# EAGLE design Dashboard rev0 (EAGLE 7.7.0)
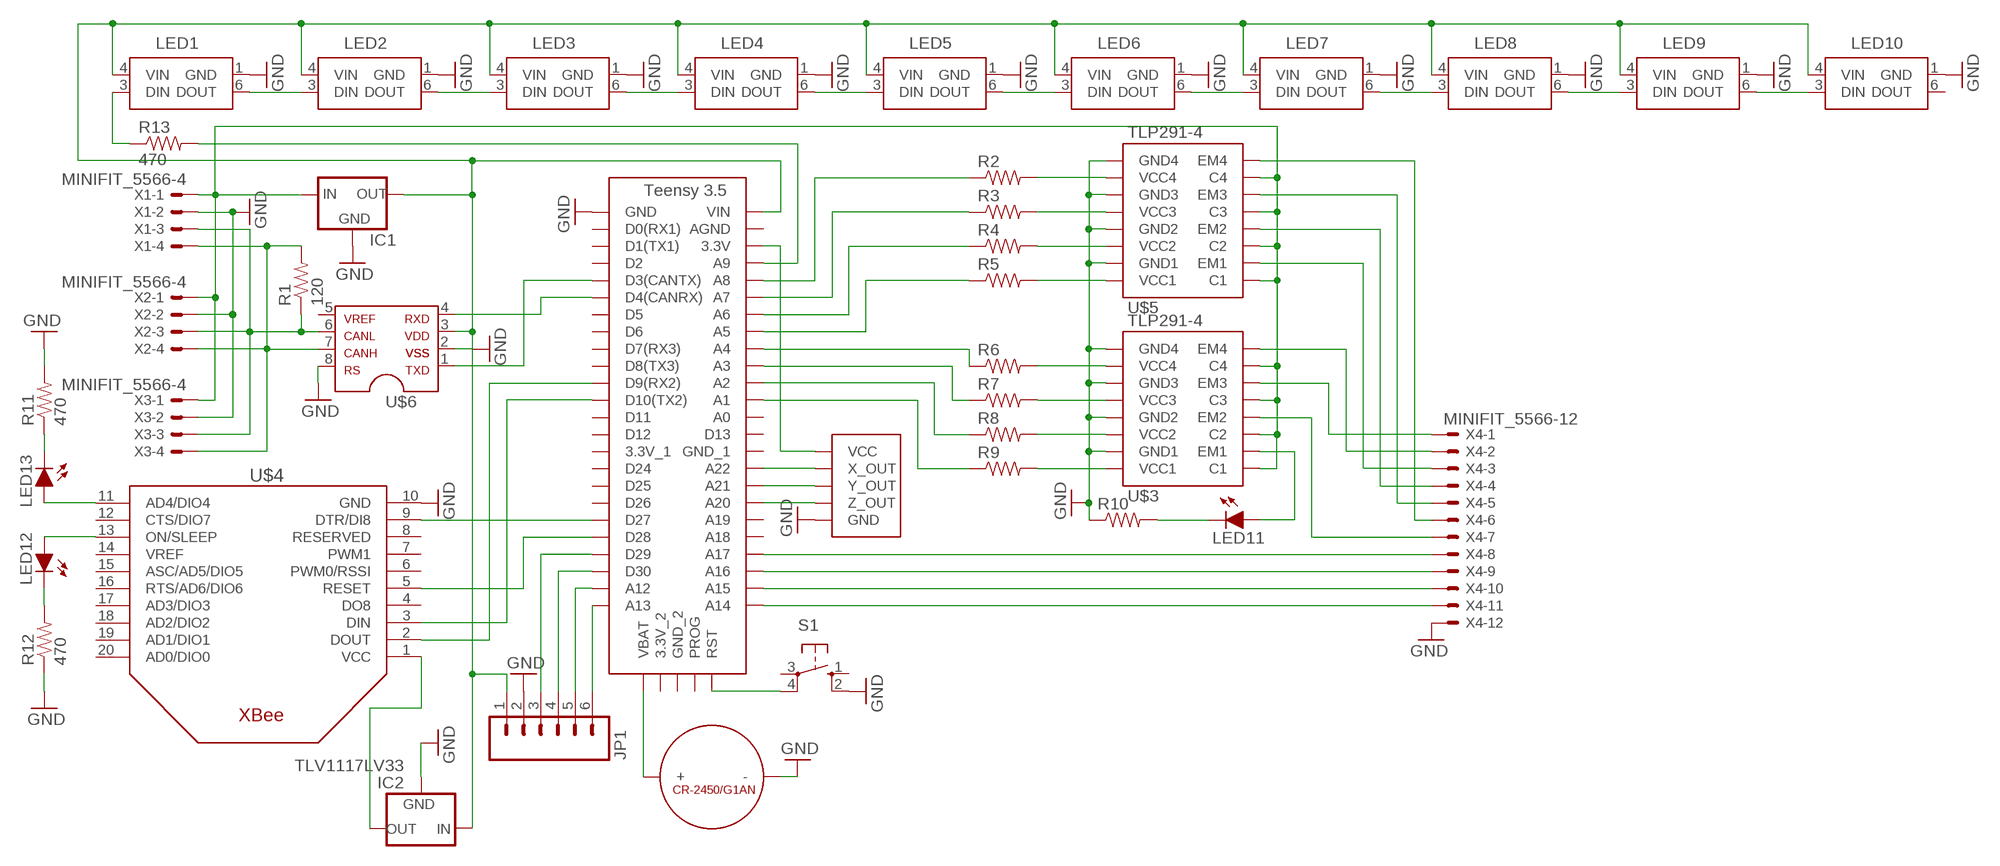
[diagram p0: schematic, sheet 1]

## Parts
IC1  5VREG_L7805_HOR  [TO-220-H]
IC2  TLV1117LV33  [SOT223]
JP1  M06  [1X06]
LED1  WS2812B5050  [RGBLED5050]
LED2  WS2812B5050  [RGBLED5050]
LED3  WS2812B5050  [RGBLED5050]
LED4  WS2812B5050  [RGBLED5050]
LED5  WS2812B5050  [RGBLED5050]
LED6  WS2812B5050  [RGBLED5050]
LED7  WS2812B5050  [RGBLED5050]
LED8  WS2812B5050  [RGBLED5050]
LED9  WS2812B5050  [RGBLED5050]
LED10  WS2812B5050  [RGBLED5050]
LED11  LED-0805  [LED-805]
LED12  LED-0805  [LED-805]
LED13  LED-0805  [LED-805]
R1  120  RESISTOR0805-RES  [0805]
R2  RESISTOR0805-RES  [0805]
R3  RESISTOR0805-RES  [0805]
R4  RESISTOR0805-RES  [0805]
R5  RESISTOR0805-RES  [0805]
R6  RESISTOR0805-RES  [0805]
R7  RESISTOR0805-RES  [0805]
R8  RESISTOR0805-RES  [0805]
R9  RESISTOR0805-RES  [0805]
R10  RESISTOR0805-RES  [0805]
R11  470  RESISTOR0805-RES  [0805]
R12  470  RESISTOR0805-RES  [0805]
R13  470  RESISTOR0805-RES  [0805]
S1  BTN_10-XX  [B3F-10XX]
U$1  TEENSY_3.5_SIMPLE_RTC  [TEENSY_3.5_SIMPLE_RTC]
U$2  CR-2450/G1AN  [CR-2450/G1AN]
U$3  TLP291-4  [SOIC-16]
U$4  XBEE  [XBEE]
U$5  TLP291-4  [SOIC-16]
U$6  MCP2551  [SOIC-08]
U$7  ADXL335  [ADXL335]
X1  MINIFIT_5566-4  [MINIFIT_5566-4]
X2  MINIFIT_5566-4  [MINIFIT_5566-4]
X3  MINIFIT_5566-4  [MINIFIT_5566-4]
X4  MINIFIT_5566-12  [MINIFIT_5566-12]

## Nets
GND: IC1.2(GND) IC2.1(GND) JP1.2 LED1.1(GND) LED2.1(GND) LED3.1(GND) LED4.1(GND) LED5.1(GND) LED6.1(GND) LED7.1(GND) LED8.1(GND) LED9.1(GND) LED10.1(GND) R10.1 R11.2 R12.1 S1.2(S1) U$1.GND U$2.- U$3.2(GND1) U$3.4(GND2) U$3.6(GND3) U$3.8(GND4) U$4.10(GND) U$5.2(GND1) U$5.4(GND2) U$5.6(GND3) U$5.8(GND4) U$6.2 U$6.8 U$7.GND X1.2 X2.2 X3.2 X4.12
N$1: U$1.VBAT U$2.+_0(+) U$2.+_1(+)
N$2: R2.2 U$5.7(VCC4)
N$3: LED1.6(DOUT) LED2.3(DIN)
N$4: LED2.6(DOUT) LED3.3(DIN)
N$5: LED3.6(DOUT) LED4.3(DIN)
N$6: LED4.6(DOUT) LED5.3(DIN)
N$7: LED5.6(DOUT) LED6.3(DIN)
N$8: LED6.6(DOUT) LED7.3(DIN)
N$9: LED7.6(DOUT) LED8.3(DIN)
N$10: LED8.6(DOUT) LED9.3(DIN)
N$11: LED9.6(DOUT) LED10.3(DIN)
N$12: R3.2 U$5.5(VCC3)
N$13: U$1.D3(CANTX) U$6.1
N$14: IC1.1(IN) U$3.10(C4) U$3.12(C3) U$3.14(C2) U$3.16(C1) U$5.10(C4) U$5.12(C3) U$5.14(C2) U$5.16(C1) X1.1 X2.1 X3.1
N$15: U$1.D4(CANRX) U$6.4
N$16: R1.1 U$6.6 X1.3 X2.3 X3.3
N$17: R1.2 U$6.7 X1.4 X2.4 X3.4
N$18: LED12.A U$4.13(ON/SLEEP)
N$19: R13.2 U$1.A9
N$20: R2.1 U$1.A8
N$21: R3.1 U$1.A7
N$22: R4.1 U$1.A6
N$23: R5.1 U$1.A5
N$24: R6.1 U$1.A4
N$25: R7.1 U$1.A3
N$26: R8.1 U$1.A2
N$27: R9.1 U$1.A1
N$28: R4.2 U$5.3(VCC2)
N$29: R5.2 U$5.1(VCC1)
N$30: R6.2 U$3.7(VCC4)
N$31: R7.2 U$3.5(VCC3)
N$32: R8.2 U$3.3(VCC2)
N$33: R9.2 U$3.1(VCC1)
N$36: U$1.3.3V U$7.VCC
N$37: U$1.A22 U$7.X_OUT
N$38: U$1.A21 U$7.Y_OUT
N$39: U$1.A20 U$7.Z_OUT
N$40: S1.4(P1) U$1.RST
N$41: U$1.D28 U$4.5(RESET)
N$42: U$1.A14 X4.11
N$43: U$1.A16 X4.9
N$44: U$5.9(EM4) X4.6
N$45: U$5.11(EM3) X4.5
N$46: U$5.13(EM2) X4.4
N$47: U$5.15(EM1) X4.3
N$48: U$3.9(EM4) X4.2
N$49: U$3.11(EM3) X4.1
N$50: U$3.13(EM2) X4.7
N$51: LED11.A U$3.15(EM1)
N$52: U$1.A17 X4.8
N$53: U$1.A15 X4.10
N$54: U$1.D9(RX2) U$4.2(DOUT)
N$55: U$1.D10(TX2) U$4.3(DIN)
N$56: U$1.D27 U$4.9(DTR/DI8)
N$57: LED11.C R10.2
N$58: LED13.A U$4.11(AD4/DIO4)
N$59: LED13.C R11.1
N$60: LED12.C R12.2
N$61: IC1.3(OUT) IC2.3(IN) JP1.1 LED1.4(VIN) LED2.4(VIN) LED3.4(VIN) LED4.4(VIN) LED5.4(VIN) LED6.4(VIN) LED7.4(VIN) LED8.4(VIN) LED9.4(VIN) LED10.4(VIN) U$1.VIN U$6.3
N$62: JP1.5 U$1.A12
N$63: JP1.4 U$1.D30
N$64: JP1.3 U$1.D29
N$65: JP1.6 U$1.A13
N$66: LED1.3(DIN) R13.1
VCC: IC2.2(OUT) IC2.4(OUT) U$4.1(VCC)
Unconnected: LED10.6(DOUT) S1.1(S) S1.3(P) U$1.3.3V_1 U$1.3.3V_2 U$1.A0 U$1.A18 U$1.A19 U$1.AGND U$1.D0(RX1) U$1.D1(TX1) U$1.D2 U$1.D5 U$1.D6 U$1.D7(RX3) U$1.D8(TX3) U$1.D11 U$1.D12 U$1.D13 U$1.D24 U$1.D25 U$1.D26 U$1.GND_1 U$1.GND_2 U$1.PROG U$4.4(DO8) U$4.6(PWM0/RSSI) U$4.7(PWM1) U$4.8(RESERVED) U$4.12(CTS/DIO7) U$4.14(VREF) U$4.15(ASC/AD5/DIO5) U$4.16(RTS/AD6/DIO6) U$4.17(AD3/DIO3) U$4.18(AD2/DIO2) U$4.19(AD1/DIO1) U$4.20(AD0/DIO0) U$6.5

## Library data of the parts
IC1 = HyTechDevices:5VREG_L7805: Voltage Regulator Switching 5v regulator Datasheet <http://power.murata.com/data/power/oki-78sr.pdf> Standard 7805 5V regulator. IGO (Input Ground Output). Spark Fun Electronics SKU : COM-00107 Datasheet <http://www.mouser.com/ds/2/308/MC7800-D-94905.pdf>
IC2 = HyTechDevices:TLV1117LV33: Texas Instruments TLV1117LV33 3.3V Linear Regulator
JP1 = HyTechDevices:M06: Standard 6-pin 0.1" header. NOTES ON THE VARIANTS LOCK and LOCK_LONGPADS... This footprint was designed to help hold the alignment of a through-hole component (i.e. 6-pin header) while soldering it into place. You may notice that each hole has been shifted either up or down by 0.005 of an inch from it's more standard position (which is a perfectly straight line). This slight alteration caused the pins (the squares in the middle) to touch the edges of the holes. Because they are alternating, it causes a "brace" to hold the component in place. 0.005 has proven to be the perfect amount of "off-center" position when using our standard breakaway headers. Although looks a little odd when you look at the bare footprint, once you have a header in there, the alteration is very hard to notice. Also,if you push a header all the way into place, it is covered up entirely on the bottom side. This idea of altering the position of holes to aid alignment will be further integrated into the Sparkfun Library for other footprints. It can help hold any component with 3 or more connection pins. Note: The Sparkfun version includes many other packages including surface mount that may be of future interest. Source: Sparkfun <https://github.com/sparkfun/SparkFun-Eagle-Libraries>
LED1-LED10 = HyTechDevices:WS2812B: 4 Pin RBG LED individually addressable. Source: Adafruit
LED11-LED13 = HyTechDevices:LED: Light Emitting Diode (LED) Source: Dangerous Prototypes Eagle Library <https://github.com/DangerousPrototypes/Eagle_Part_Library>
R1-R13 = HyTechDevices:RESISTOR: Resistor Basic schematic elements and footprints for 0603, 1206, and PTH resistors.
S1 = HyTechDevices:BTN_10-XX: OMRON SWITCH; MPN: B3F-1000; OC_FARNELL: 176432; OC_NEWARK: 36M3542
U$1 = HyTechDevices:TEENSY_3.5_SIMPLE_RTC: Simple version of the Teensy 3.5 board that only uses the 2 main rows of pins, plus the perpendicular row with VBat.
U$2 = HyTechDevices:CR-2450/G1AN: Panasonic CR2450 Battery through hole.
U$3 U$5 = HyTechDevices:TLP291-4: Toshiba Quad Channel Optocoupler TLP291-4
U$4 = HyTechDevices:XBEE: Source: Adafruit <https://github.com/adafruit/Adafruit-Eagle-Library>
U$6 = HyTechDevices:MCP2551: MCP2551 High-Speed CAN Transceiver Product Webpage <https://www.microchip.com/wwwproducts/en/MCP2551> Datasheet <http://ww1.microchip.com/downloads/en/DeviceDoc/21667f.pdf> This device is outdated It is replaced by MCP2561. Comparison Page <https://www.microchip.com/wwwproducts/ProductCompare/MCP2551/MCP2561> Product Webpage <https://www.microchip.com/wwwproducts/en/MCP2561> Datasheet <http://ww1.microchip.com/downloads/en/DeviceDoc/20005167C.pdf>
U$7 = HyTechDevices:ADXL335: ADXL335 3-axis accelerometer breakout board
X1-X3 = HyTechDevices:MINIFIT_5566-4: Mini-Fit Junior connector 4 pole Source: http://www.molex.com; OC_FARNELL: unknown; OC_NEWARK: unknown
X4 = HyTechDevices:MINIFIT_5566-12: Mini-Fit Junior connector 12 pole Source: http://www.molex.com; OC_FARNELL: unknown; OC_NEWARK: unknown

## Board
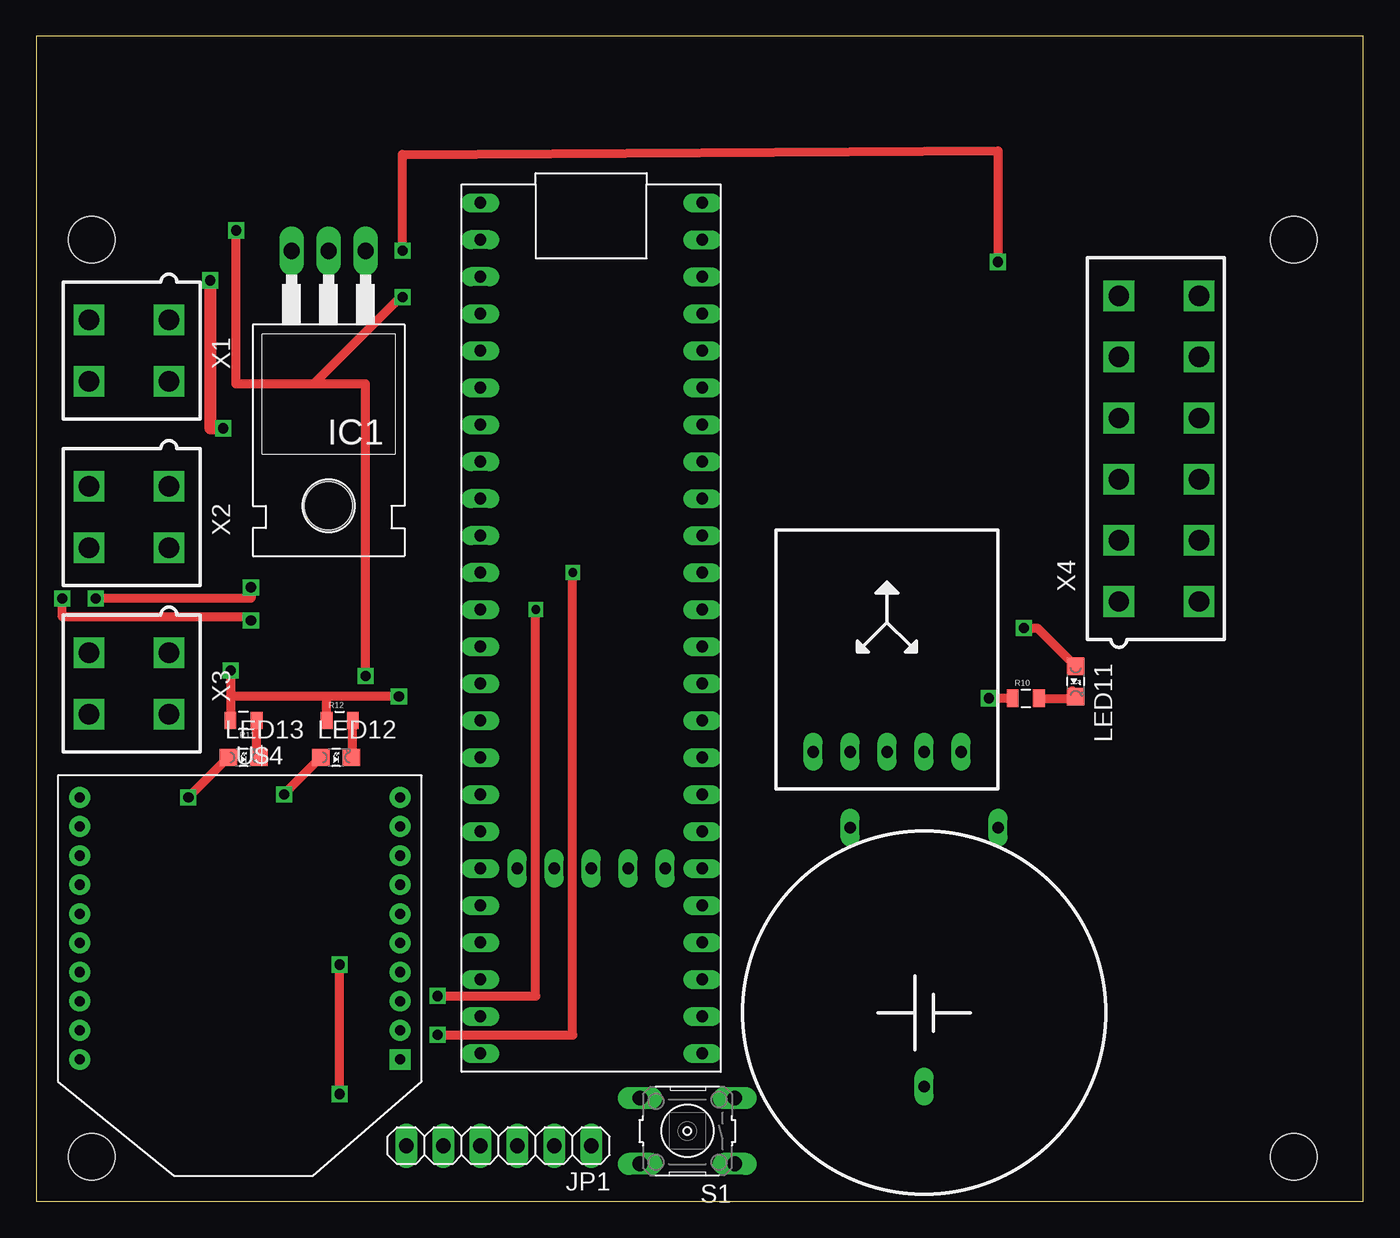
[diagram p1: board, top side]
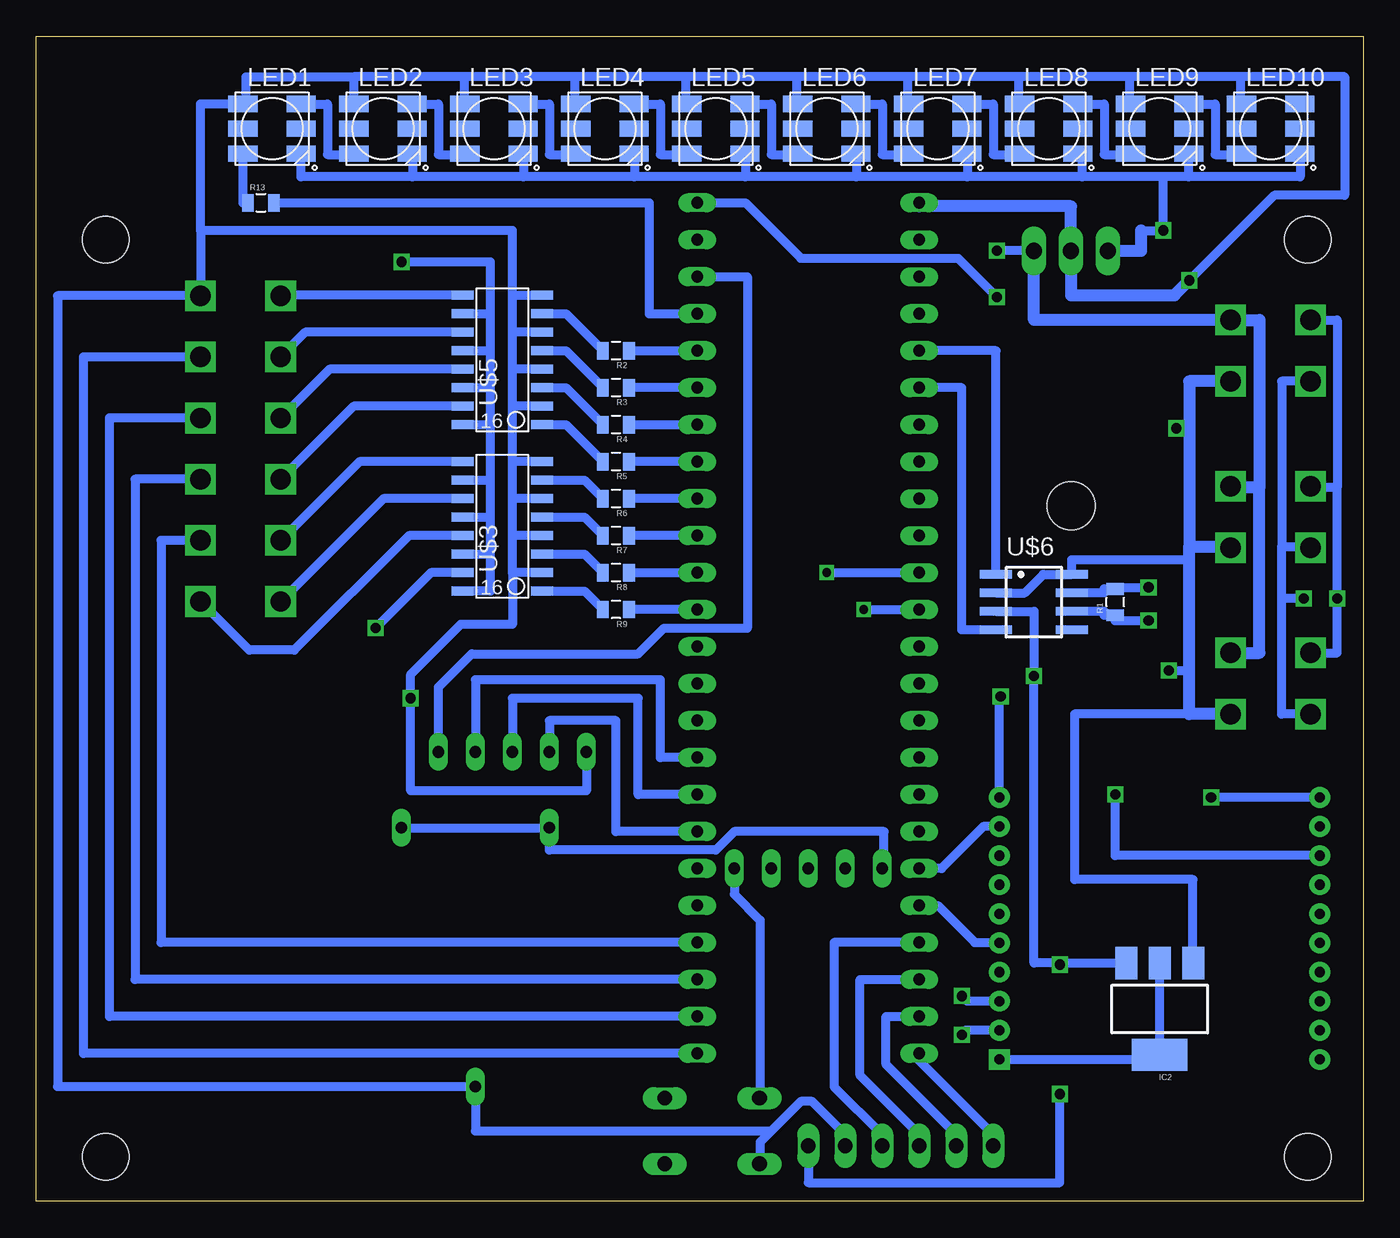
[diagram p2: board, bottom side, seen from below]

Size 91.11 x 80 mm. Coordinates in mm from the lower left corner, seen from the top.
Outline: 0,0 91.11,0 91.11,80 0,80 0,0
Copper layers (1*16): Top 0.035mm / dielectric 1.5mm / Bottom 0.035mm
Design rules "default": minimum track width 10mil, minimum drill 24mil, track to track 8mil, track to pad 8mil, pad to pad 8mil, via to via 8mil, smd to smd 8mil, copper to edge 40mil, drill to drill 8mil, minimum pad ring 10mil, minimum via ring 8mil, stop-mask expansion 4mil, vias tented up to drill 0mil, thermal gap 10mil
Holes 3.2 mm at 86.36,3.05 3.81,3.05 3.81,66.04 86.36,66.04

### Footprints (pad centres in the part's own frame; a part is rotated, then mirrored left to right if it is on the bottom)
TO-220-H = drill 1.118 long: 1 -2.54,-6.35; 2 0,-6.35; 3 2.54,-6.35 | hole 3.302: 0,11.176
SOT223 = smd 1.5 x 2.235: 1 -2.3,-3.15; 2 0,-3.15; 3 2.3,-3.15 | smd 3.8 x 2.2: 4 0,3.15
1X06 = drill 1.016 long: 1 -6.35,0; 2 -3.81,0; 3 -1.27,0; 4 1.27,0; 5 3.81,0; 6 6.35,0
RGBLED5050 = smd 2 x 1.1: 1 -2,1.7; 2 -2,0; 3 -2,-1.7; 4 2,-1.7; 5 2,0; 6 2,1.7
LED-805 = smd 1.2 x 1.2: A 0,-1.05; C 0,1.05
0805 = smd 0.8 x 1.2: 1 -0.9,0; 2 0.9,0
B3F-10XX = drill 1.016 long: 1 -3.251,2.261; 2 3.251,2.261; 3 -3.251,-2.261; 4 3.251,-2.261
TEENSY_3.5_SIMPLE_RTC = drill 0.8 long: 3.3V 16.51,54.61; 3.3V_1 1.27,24.13; 3.3V_2 6.35,13.97; A0 16.51,29.21; A1 16.51,31.75; A2 16.51,34.29; A3 16.51,36.83; A4 16.51,39.37; A5 16.51,41.91; A6 16.51,44.45; A7 16.51,46.99; A8 16.51,49.53; A9 16.51,52.07; A12 1.27,3.81; A13 1.27,1.27; A14 16.51,1.27; A15 16.51,3.81; A16 16.51,6.35; A17 16.51,8.89; A18 16.51,11.43; A19 16.51,13.97; A20 16.51,16.51; A21 16.51,19.05; A22 16.51,21.59; AGND 16.51,57.15; D0(RX1) 1.27,57.15; D1(TX1) 1.27,54.61; D2 1.27,52.07; D3(CANTX) 1.27,49.53; D4(CANRX) 1.27,46.99; D5 1.27,44.45; D6 1.27,41.91; D7(RX3) 1.27,39.37; D8(TX3) 1.27,36.83; D9(RX2) 1.27,34.29; D10(TX2) 1.27,31.75; D11 1.27,29.21; D12 1.27,26.67; D13 16.51,26.67; D24 1.27,21.59; D25 1.27,19.05; D26 1.27,16.51; D27 1.27,13.97; D28 1.27,11.43; D29 1.27,8.89; D30 1.27,6.35; GND 1.27,59.69; GND_1 16.51,24.13; GND_2 8.89,13.97; PROG 11.43,13.97; RST 13.97,13.97; VBAT 3.81,13.97; VIN 16.51,59.69
CR-2450/G1AN = drill 0.8 long: +_0 -5.08,12.7; +_1 5.08,12.7; - 0,-5.08
SOIC-16 = smd 0.61 x 1.524: 1 -4.445,-2.794; 2 -3.175,-2.794; 3 -1.905,-2.794; 4 -0.635,-2.794; 5 0.635,-2.794; 6 1.905,-2.794; 7 3.175,-2.794; 8 4.445,-2.794; 9 4.445,2.667; 10 3.175,2.667; 11 1.905,2.667; 12 0.635,2.667; 13 -0.635,2.667; 14 -1.905,2.667; 15 -3.175,2.667; 16 -4.445,2.667
XBEE = drill 0.7 pad 1.422 square: 1 -11,5.5 | drill 0.7 pad 1.422: 2 -11,3.5; 3 -11,1.5; 4 -11,-0.5; 5 -11,-2.5; 6 -11,-4.5; 7 -11,-6.5; 8 -11,-8.5; 9 -11,-10.5; 10 -11,-12.5; 11 11,-12.5; 12 11,-10.5; 13 11,-8.5; 14 11,-6.5; 15 11,-4.5; 16 11,-2.5; 17 11,-0.5; 18 11,1.5; 19 11,3.5; 20 11,5.5
SOIC-08 = smd 0.6 x 2.2: 1 -1.905,-2.6; 2 -0.635,-2.6; 3 0.635,-2.6; 4 1.905,-2.6; 5 1.905,2.6; 6 0.635,2.6; 7 -0.635,2.6; 8 -1.905,2.6
ADXL335 = drill 0.8 long: GND 2.54,2.54; VCC 12.7,2.54; X_OUT 10.16,2.54; Y_OUT 7.62,2.54; Z_OUT 5.08,2.54
MINIFIT_5566-4 = drill 1.4 square: 1 2.1,-2.75; 2 -2.1,-2.75; 3 2.1,2.75; 4 -2.1,2.75
MINIFIT_5566-12 = drill 1.4 square: 1 10.5,-2.75; 2 6.3,-2.75; 3 2.1,-2.75; 4 -2.1,-2.75; 5 -6.3,-2.75; 6 -10.5,-2.75; 7 10.5,2.75; 8 6.3,2.75; 9 2.1,2.75; 10 -2.1,2.75; 11 -6.3,2.75; 12 -10.5,2.75

### Placement (x,y rotation side)
IC1  20.07,58.93 180 top
IC2  13.97,13.21 180 bottom
JP1  31.75,3.81 180 top
LED1  74.93,73.66 0 bottom
LED2  67.31,73.66 0 bottom
LED3  59.69,73.66 0 bottom
LED4  52.07,73.66 0 bottom
LED5  44.45,73.66 0 bottom
LED6  36.83,73.66 0 bottom
LED7  29.21,73.66 0 bottom
LED8  21.59,73.66 0 bottom
LED9  13.97,73.66 0 bottom
LED10  6.35,73.66 0 bottom
LED11  71.37,35.69 180 top
LED12  20.57,30.48 270 top
LED13  14.22,30.48 270 top
R1  17.02,41.15 90 bottom
R2  51.31,58.42 180 bottom
R3  51.31,55.88 180 bottom
R4  51.31,53.34 180 bottom
R5  51.31,50.8 180 bottom
R6  51.31,48.26 180 bottom
R7  51.31,45.72 180 bottom
R8  51.31,43.18 180 bottom
R9  51.31,40.64 180 bottom
R10  67.94,34.54 0 top
R11  14.22,33.02 180 top
R12  20.83,33.02 0 top
R13  75.69,68.58 0 bottom
S1  44.7,4.83 180 top
U$1  29.21,8.89 0 top
U$2  60.96,12.95 0 top
U$3  59.18,46.35 90 bottom
U$4  13.97,15.24 180 top
U$5  59.18,57.78 90 bottom
U$6  22.61,41.15 270 bottom
U$7  50.8,28.32 0 top
X1  6.35,58.42 90 top
X2  6.35,46.99 90 top
X3  6.35,35.56 90 top
X4  77.09,51.69 270 top

### Tracks (layer width: path | path; a pad name or v marks a point on that pad's centre or on a via)
GND  (via drill 0.7)
  Top 0.61: R12.1 19.93,34.67 | 19.93,34.67 13.34,34.67 | 13.34,34.67 13.34,33.02 R11.2 | v24.89,34.67 19.93,34.67 | v13.34,36.45 13.34,34.67 | R10.1 v65.41,34.54
  Top 0.813: v11.94,63.25 11.94,53.09 v12.83,53.09
  Bottom 0.61: 69.31,77.22 76.71,77.22 76.71,75.36 LED1.1 79.84,75.36 79.84,66.67 | 69.31,77.22 LED2.1 | LED3.1 61.72,75.36 61.72,77.22 | 61.72,77.22 69.31,77.22 | LED4.1 54.1,75.36 54.1,77.22 | 54.1,77.22 61.72,77.22 | LED10.1 8.38,75.36 8.38,77.22 | 8.38,77.22 16,77.22 | 16,77.22 23.62,77.22 | 23.62,77.22 31.24,77.22 | 31.24,77.22 38.86,77.22 | 38.86,77.22 46.48,77.22 | 46.48,77.22 54.1,77.22 | LED9.1 16,75.36 16,77.22 | LED8.1 23.62,75.36 23.62,77.22 | LED7.1 31.24,75.36 31.24,77.22 | LED6.1 38.86,75.36 38.86,77.22 | LED5.1 46.48,75.36 46.48,77.22 | 11.94,33.46 19.81,33.46 19.81,22.1 11.68,22.1 11.68,16.36 IC2.1 | JP1.2 35.56,4.57 37.85,6.86 38.61,6.86 40.64,4.83 | 40.64,4.83 41.4,4.06 41.4,2.62 S1.2 | 8.38,77.22 1.27,77.22 1.27,69.09 6.1,69.09 v11.94,63.25 | 40.64,4.83 60.96,4.83 U$2.- 89.66,7.87 89.66,62.19 X4.12 79.84,66.67 | U$6.2 23.24,41.78 21.97,43.05 U$6.8 20.01,44.07 11.94,44.07 | U$4.10 24.97,34.54 v24.89,34.67 | v13.34,36.45 11.94,36.45 | U$3.2 58.42,43.18 | 58.42,43.18 58.42,45.72 | 58.42,45.72 58.42,48.26 | 58.42,48.26 58.42,50.8 | 58.42,50.8 58.42,54.61 | 58.42,54.61 58.42,57.15 | 58.42,57.15 58.42,59.69 | 58.42,59.69 58.42,62.23 | 58.42,62.23 U$5.8 | U$5.6 58.42,59.69 | U$5.4 58.42,57.15 | U$5.2 58.42,54.61 | U$3.8 58.42,50.8 | U$3.6 58.42,48.26 | U$3.4 58.42,45.72 | 58.42,62.23 58.42,66.67 79.84,66.67 | U$7.GND 53.34,28.19 65.41,28.19 v65.41,34.54 65.41,36.2 61.98,39.62 58.42,39.62 58.42,43.18
  Bottom 0.813: X1.2 11.94,56.32 11.94,52.96 | 11.94,52.96 11.94,44.96 | 11.94,44.96 9.1,44.96 | X3.2 11.94,33.46 11.94,36.45 11.94,44.07 11.94,44.96 | U$1.GND 30.48,68.33 20.07,68.33 IC1.2 20.07,62.23 12.95,62.23 v11.94,63.25 | v12.83,53.09 12.06,53.09 11.94,52.96
  Bottom 1.016: 9.1,44.96 X2.2
N$1
  Bottom 0.61: U$2.+_1 U$2.+_0 55.88,24.13 44.45,24.13 43.18,25.4 32.89,25.4 32.89,22.86 U$1.VBAT
N$2
  Bottom 0.61: U$5.7 54.75,60.96 R2.2
N$3
  Bottom 0.61: LED1.6 71.12,75.36 71.12,71.88 69.31,71.88 LED2.3
N$4
  Bottom 0.61: LED2.6 63.5,75.36 63.5,71.88 61.69,71.88 LED3.3
N$5
  Bottom 0.61: LED3.6 55.88,75.36 55.88,71.88 54.07,71.88 LED4.3
N$6
  Bottom 0.61: LED4.6 48.26,75.36 48.26,71.88 46.45,71.88 LED5.3
N$7
  Bottom 0.61: LED5.6 40.64,75.36 40.64,71.88 38.83,71.88 LED6.3
N$8
  Bottom 0.61: LED6.6 33.02,75.36 33.02,71.88 31.21,71.88 LED7.3
N$9
  Bottom 0.61: LED7.6 25.4,75.36 25.4,71.88 23.59,71.88 LED8.3
N$10
  Bottom 0.61: LED8.6 17.78,75.36 17.78,71.88 15.97,71.88 LED9.3
N$11
  Bottom 0.61: LED9.6 10.16,75.36 10.16,71.88 8.35,71.88 LED10.3
N$12
  Bottom 0.61: U$5.5 54.75,58.42 R3.2
N$13
  Bottom 0.61: U$6.1 25.21,58.42 U$1.D3(CANTX)
N$14  (via drill 0.7)
  Top 0.61: v25.15,65.28 25.15,71.88 66.04,72.14 v66.04,64.52
  Bottom 0.61: IC1.1 v25.15,65.28 | U$5.10 59.94,60.96 | 59.94,60.96 59.94,58.42 | 59.94,58.42 59.94,55.88 | 59.94,55.88 59.94,53.34 | 59.94,53.34 59.94,49.53 | 59.94,49.53 59.94,46.99 | 59.94,46.99 59.94,44.45 | 59.94,44.45 59.94,41.91 U$3.16 | U$3.14 59.94,44.45 | U$3.12 59.94,46.99 | U$3.10 59.94,49.53 | U$5.16 59.94,53.34 | U$5.14 59.94,55.88 | U$5.12 59.94,58.42 | v66.04,64.52 59.94,64.52 59.94,60.96
  Bottom 0.813: 7.11,49.02 7.11,60.52 X1.1 22.61,60.52 IC1.1 | 7.11,49.02 9.1,49.02 | X3.1 7.11,37.66 7.11,49.02
  Bottom 1.016: 9.1,49.02 X2.1
N$15
  Bottom 0.61: U$6.4 27.56,39.24 27.56,55.88 U$1.D4(CANRX)
N$16  (via drill 0.7)
  Top 0.61: v14.73,39.88 14.73,40.13 1.78,40.13 v1.78,41.4
  Bottom 0.61: X1.3 1.78,60.52 1.78,49.02 | 1.78,49.02 3.6,49.02 X2.3 | X3.3 1.78,37.66 v1.78,41.4 1.78,49.02 | v14.73,39.88 17.02,39.88 R1.1 17.78,40.25 17.78,40.51 U$6.6
N$17  (via drill 0.7)
  Top 0.61: v14.73,42.16 14.73,41.4 v4.06,41.4
  Bottom 0.61: X1.4 5.59,56.32 5.59,44.96 | 5.59,44.96 3.6,44.96 X2.4 | X3.4 5.59,33.46 5.59,41.4 | 5.59,41.4 5.59,44.96 | v14.73,42.16 17.02,42.16 R1.2 17.78,42.05 17.78,41.78 U$6.7 | v4.06,41.4 5.59,41.4
N$18  (via drill 0.7)
  Top 0.61: v17.02,27.94 17.02,27.97 LED12.A
  Bottom 0.61: U$4.13 17.02,23.74 v17.02,27.94
N$19
  Bottom 0.61: R13.2 49.02,68.58 49.02,60.96 U$1.A9
N$20
  Bottom 0.61: R2.1 U$1.A8
N$21
  Bottom 0.61: U$1.A7 R3.1
N$22
  Bottom 0.61: R4.1 U$1.A6
N$23
  Bottom 0.61: U$1.A5 R5.1
N$24
  Bottom 0.61: U$1.A4 R6.1
N$25
  Bottom 0.61: U$1.A3 R7.1
N$26
  Bottom 0.61: R8.1 U$1.A2
N$27
  Bottom 0.61: U$1.A1 R9.1
N$28
  Bottom 0.61: U$5.3 54.75,55.88 R4.2
N$29
  Bottom 0.61: U$5.1 54.75,53.34 R5.2
N$30
  Bottom 0.61: U$3.7 53.48,49.53 R6.2
N$31
  Bottom 0.61: U$3.5 53.48,46.99 R7.2
N$32
  Bottom 0.61: U$3.3 53.48,44.45 R8.2
N$33
  Bottom 0.61: U$3.1 53.48,41.91 R9.2
N$36
  Bottom 0.61: U$1.3.3V 42.29,63.5 42.29,39.37 48.01,39.37 49.78,37.59 61.21,37.59 63.5,35.31 U$7.VCC
N$37
  Bottom 0.61: U$1.A22 48.26,30.48 48.26,35.81 60.96,35.81 U$7.X_OUT
N$38
  Bottom 0.61: U$1.A21 49.78,27.94 49.78,34.54 58.42,34.54 U$7.Y_OUT
N$39
  Bottom 0.61: U$1.A20 51.31,25.4 51.31,33.02 55.88,33.02 U$7.Z_OUT
N$40
  Bottom 0.61: U$1.RST 43.18,21.08 41.4,19.3 41.4,7.14 S1.4
N$41
  Bottom 0.61: U$1.D28 29.21,20.32 26.67,17.78 24.97,17.78 U$4.5
N$42
  Bottom 0.61: U$1.A14 87.88,10.16 87.88,57.99 X4.11
N$43
  Bottom 0.61: U$1.A16 84.33,15.24 84.33,49.59 X4.9
N$44
  Bottom 0.61: U$5.9 74.3,62.23 X4.6
N$45
  Bottom 0.61: U$5.11 72.64,59.69 X4.5
N$46
  Bottom 0.61: U$5.13 70.98,57.15 X4.4
N$47
  Bottom 0.61: U$5.15 69.32,54.61 X4.3
N$48
  Bottom 0.61: U$3.9 68.93,50.8 X4.2
N$49
  Bottom 0.61: U$3.11 67.27,48.26 X4.1
N$50
  Bottom 0.61: U$3.13 65.53,45.72 73.41,37.85 76.5,37.85 X4.7
N$51  (via drill 0.7)
  Top 0.61: v67.82,39.37 68.74,39.37 LED11.A
  Bottom 0.61: U$3.15 64.01,43.18 v67.82,39.37
N$52
  Bottom 0.61: U$1.A17 82.55,17.78 82.55,45.39 X4.8
N$53
  Bottom 0.61: U$1.A15 86.11,12.7 86.11,53.79 X4.10
N$54  (via drill 0.6, 0.7)
  Top 0.61: v27.56,11.43 36.83,11.43 v36.83,43.18
  Bottom 0.61: U$4.2 27.25,11.74 v27.56,11.43 | v36.83,43.18 U$1.D9(RX2)
N$55  (via drill 0.6, 0.7)
  Top 0.61: v27.56,14.1 34.29,14.1 v34.29,40.64
  Bottom 0.61: U$4.3 27.2,13.74 v27.56,14.1 | v34.29,40.64 U$1.D10(TX2)
N$56
  Bottom 0.61: U$4.9 26.08,25.74 28.96,22.86 U$1.D27
N$57
  Top 0.61: 71.12,35.05 LED11.C 71.28,34.54 R10.2
N$58  (via drill 0.7)
  Top 0.61: v10.43,27.74 LED13.A
  Bottom 0.61: U$4.11 v10.43,27.74
N$59
  Top 0.61: LED13.C 15.12,30.48 R11.1
N$60
  Top 0.61: LED12.C 21.73,30.48 R12.2
N$61  (via drill 0.7)
  Top 0.61: v20.83,7.37 v20.83,16.26 | v22.61,36.07 22.61,56.13 19.05,56.13 | 19.05,56.13 13.72,56.13 v13.72,66.67 | v25.15,62.1 25.02,62.1 19.05,56.13
  Bottom 0.61: LED10.4 4.32,71.96 4.32,70.36 11.97,70.36 | 11.97,70.36 LED9.4 | LED8.4 19.3,71.96 19.3,70.36 | 19.3,70.36 27.18,70.36 | 27.18,70.36 34.8,70.36 | 34.8,70.36 42.42,70.36 | 42.42,70.36 50.04,70.36 | 50.04,70.36 57.66,70.36 | 57.66,70.36 65.28,70.36 | 65.28,70.36 72.93,70.36 LED1.4 | LED2.4 65.28,71.96 65.28,70.36 | LED5.4 42.42,71.96 42.42,70.36 | LED6.4 34.8,71.96 34.8,70.36 | LED7.4 27.18,71.96 27.18,70.36 | 11.97,70.36 13.72,70.36 | 13.72,70.36 19.3,70.36 | LED4.4 50.04,71.96 50.04,70.36 | LED3.4 57.66,71.96 57.66,70.36 | JP1.1 38.1,1.27 20.83,1.27 v20.83,7.37 | v20.83,16.26 20.83,16.36 | 20.83,16.36 IC2.3 | U$6.3 22.61,40.51 v22.61,36.07 22.61,16.36 20.83,16.36 | U$1.VIN 42.42,68.58 38.61,64.77 27.81,64.77 v25.15,62.1 | 15.24,66.67 v13.72,66.67 13.72,70.36
  Bottom 0.813: IC1.3 15.24,65.28 15.24,66.67
N$62
  Bottom 0.61: JP1.5 27.94,4.57 32.77,9.4 32.77,12.7 U$1.A12
N$63
  Bottom 0.61: U$1.D30 34.54,15.24 34.54,8.64 30.48,4.57 JP1.4
N$64
  Bottom 0.61: U$1.D29 36.32,17.78 36.32,7.87 33.02,4.57 JP1.3
N$65
  Bottom 0.61: JP1.6 25.4,4.57 30.48,9.65 U$1.A13
N$66
  Bottom 0.61: LED1.3 76.93,68.58 R13.1
VCC
  Bottom 0.61: U$4.1 13.97,9.74 IC2.4 IC2.2